# Altium project traitim.PrjPcb
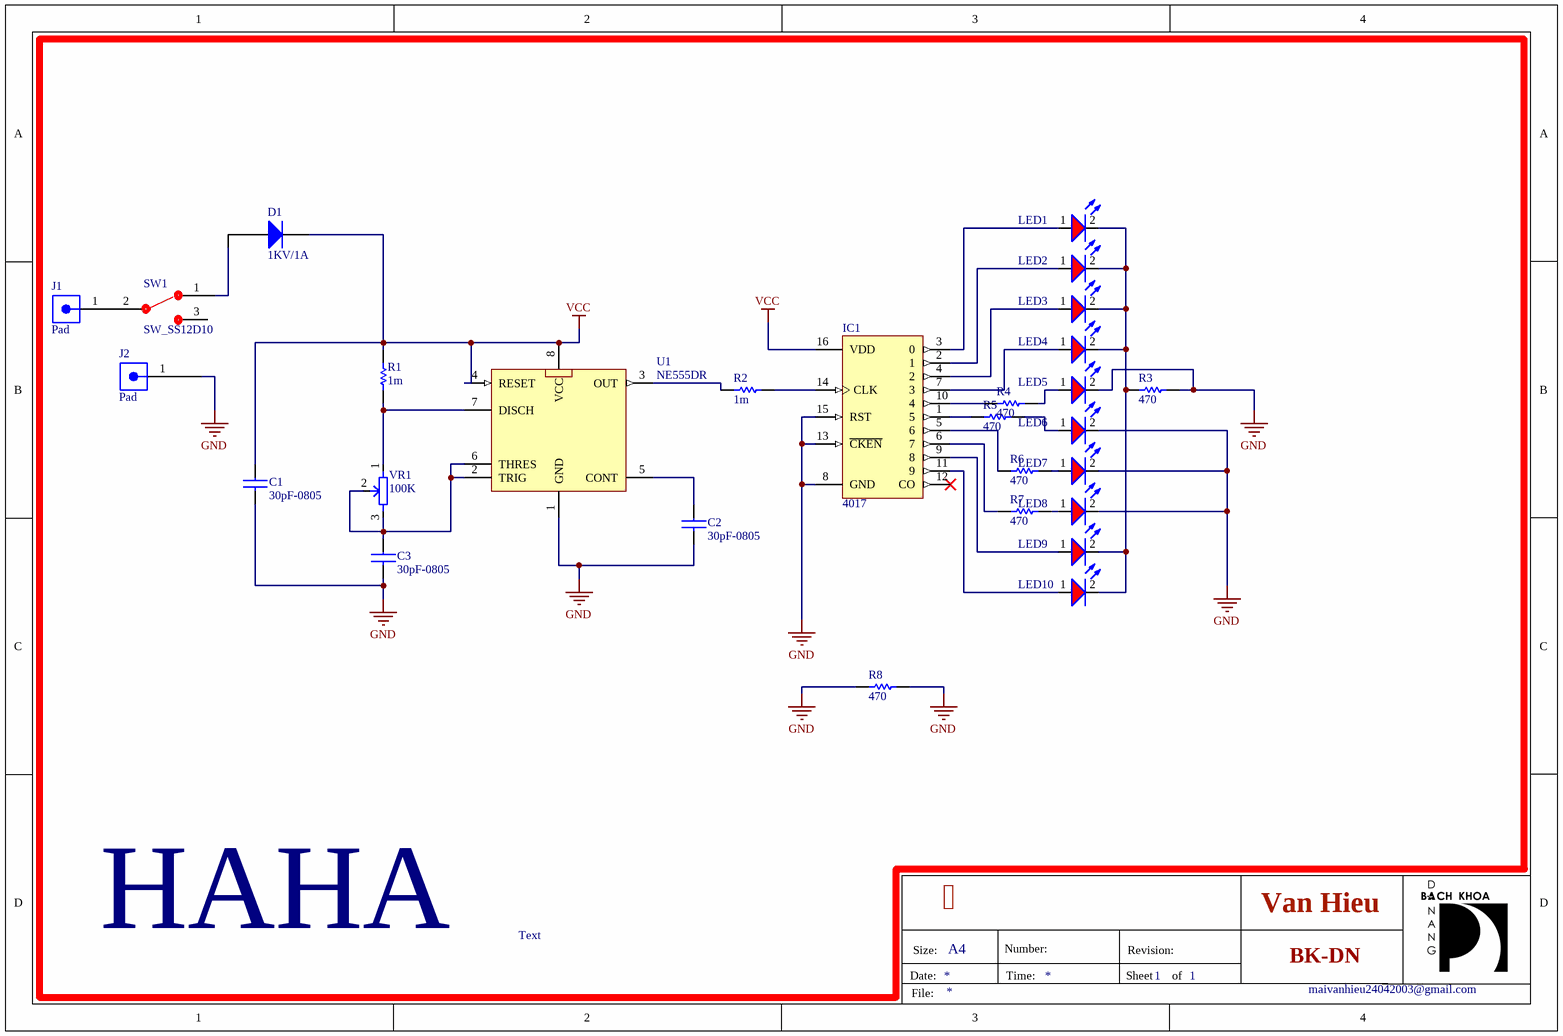
[diagram p0: Sheet2.SchDoc]
1 sheet, 28 parts. Net scope: global (net labels, ports and power ports of the same name join across sheets).
Board file: PCB2.PcbDoc

## Sheet Sheet2.SchDoc
size A4; Author: Van Hieu; Organization: BACH-KHOA-DK; SheetNumber: 1; SheetTotal: 1; Gmail: maivanhieu24042003@gmail.com

### Parts
C1  30pF-0805  [CAP0805]
C2  30pF-0805  [CAP0805]
C3  30pF-0805  [CAP0805]
D1  1KV/1A  [DIO-DO41(DO-204AL)-10P-THR]
IC1  4017  [DIP16/W0.3]
J1  Pad  [pad_smd_2x3]
J2  Pad  [pad_smd_2x3]
LED1  LED_R_5  [LED5R]  (value not drawn)
LED2  LED_R_5  [LED5R]  (value not drawn)
LED3  LED_R_5  [LED5R]  (value not drawn)
LED4  LED_R_5  [LED5R]  (value not drawn)
LED5  LED_R_5  [LED5R]  (value not drawn)
LED6  LED_R_5  [LED5R]  (value not drawn)
LED7  LED_R_5  [LED5R]  (value not drawn)
LED8  LED_R_5  [LED5R]  (value not drawn)
LED9  LED_R_5  [LED5R]  (value not drawn)
LED10  LED_R_5  [LED5R]  (value not drawn)
R1  value 1m  [RESC2012L]  (hidden comment: Resistor 10K-0805)
R2  value 1m  [RESC2012L]  (hidden comment: Resistor 10K-0805)
R3  value 470  [RES 1/4W CFR25]  (hidden comment: CF1/4W1KJ25)
R4  value 470  [RES 1/4W CFR25]  (hidden comment: CF1/4W1KJ25)
R5  value 470  [RES 1/4W CFR25]  (hidden comment: CF1/4W1KJ25)
R6  value 470  [RES 1/4W CFR25]  (hidden comment: CF1/4W1KJ25)
R7  value 470  [RES 1/4W CFR25]  (hidden comment: CF1/4W1KJ25)
R8  value 470  [RES 1/4W CFR25]  (hidden comment: CF1/4W1KJ25)
SW1  SW_SS12D10  [SW_SS12D10]
U1  NE555DR  [SOIC-8]
VR1  100K  [Bien Tro Tam Giac Dung]

### Nets
GND: C1.2 C2.2 C3.2 IC1.8(GND) IC1.13(~{CKEN}) IC1.15(RST) J2.1 LED5.2(K) LED6.2(K) LED7.2(K) LED8.2(K) R3.1 R8.1 R8.2 U1.1(GND)
VCC: C1.1 D1.2(K) IC1.16(VDD) R1.2 U1.4(RESET) U1.8(VCC)
NetC2_1: C2.1 U1.5(CONT)
NetC3_1: C3.1 U1.2(TRIG) U1.6(THRES) VR1.2 VR1.3
NetD1_1: D1.1(A) SW1.1
NetIC1_1: IC1.1(5) R5.2
NetIC1_2: IC1.2(1) LED2.1(A)
NetIC1_3: IC1.3(0) LED1.1(A)
NetIC1_4: IC1.4(2) LED3.1(A)
NetIC1_5: IC1.5(6) R6.2
NetIC1_6: IC1.6(7) R7.2
NetIC1_7: IC1.7(3) LED4.1(A)
NetIC1_9: IC1.9(8) LED9.1(A)
NetIC1_10: IC1.10(4) R4.2
NetIC1_11: IC1.11(9) LED10.1(A)
NetIC1_14: IC1.14(CLK) R2.1
NetJ1_1: J1.1 SW1.2
NetLED1_2: LED1.2(K) LED2.2(K) LED3.2(K) LED4.2(K) LED9.2(K) LED10.2(K) R3.2
NetLED5_1: LED5.1(A) R4.1
NetLED6_1: LED6.1(A) R5.1
NetLED7_1: LED7.1(A) R6.1
NetLED8_1: LED8.1(A) R7.1
NetR1_1: R1.1 U1.7(DISCH) VR1.1
NetR2_2: R2.2 U1.3(OUT)

Not connected (* = marked no-connect by the designer): IC1 12(CO)*; SW1 3

### Notes on the sheet
- HAHA
- Text
- Van Hieu
- Date:
- Size:
- A4
- Number:
- Time:
- Sheet
- Revision:
- of
- BK-DN
- File:
- maivanhieu24042003@gmail.com

### Library data of the parts
C1-C3 = CC0805JRNPO9BN300: CAP CER 30PF 50V NPO 0805; Manufacturer: Yageo; Tolerance: ±5%; Temperature Coefficient: C0G, NP0; Notification: Current market demand for these product types have resulted in fluctuating and extending lead times. Lead times may differ.; Supplier 1: Digi-Key; Manufacturer Part Number: CC0805JRNPO9BN300; RoHS: RoHS Compliant; Category: Capacitors; Stock 1: 0; Pricing 1: 1=0.15, 10=0.107, 100=0.0503, 500=0.03524, 1000=0.02918 (USD); Packaging: Cut Tape (CT); Part Status: Active; Voltage - Rated: 50V; Operating Temperature: -55°C ~ 125°C; Features: High Voltage; Ratings: -; Applications: General Purpose; Failure Rate: -; Mounting Type: Surface Mount, MLCC; Package / Case: 0805 (2012 Metric); Size / Dimension: 0.079" L x 0.049" W (2.00mm x 1.25mm); Height - Seated (Max): -; Thickness (Max): 0.028" (0.70mm); Lead Spacing: -; Lead Style: -; ComponentLink1URL: http://www.yageo.com/documents/recent/UPY-GP_NP0_16V-to-50V_16.pdf; ComponentLink1Description: http://www.yageo.com/documents/recent/UPY-GP_NP0_16V-to-50V_16.pdf; Supplier Part Number 1: 311-4234-1-ND
D1 = SMC-1N4007: DIO GEN 1000V 1A DO41 THR; MFR: NA; UNIT: PCS; MFR PN: SMC-1N4007; LINK: NA; PRICE: NA
IC1 = 4017: Decade Counter/Divider with 10 Decoded Outputs; Designed by: VanDungEvn; Value: CD4017
J1 J2 = Pad: Ports: 1; Positions/Loaded: Port1 - 4/2; PerformanceCategory: 3; PCB_Mounting: Thru-Hole; PCB_Thickness: 0.125"; DrillSize: Nominal, Rounded to nearest 0.05mm; PCB_Layout: Complies with Manufacturer's Recommendation.; Published: 25-Jun-2002; DatasheetDocument: 20-Nov-2001; PackageDocument: 20-Nov-2001; PackageReference: 42878-4410; Publisher: Altium Limited; ComponentLink1Description: Manufacturer Link; ComponentLink1URL: http://www.molex.com/; ComponentLink2Description: Datasheet; ComponentLink2URL: http://www.molex.com/cmc_upload/common_files/1212003_42878catalogpage.pdf
LED1-LED10 = LED_RED_5MM: LED Red 5mm; ComponentLink1Description: Datasheet; ComponentLink1URL: D:\Dropbox\Datasheets\Opto and Illumination\LEDs\SMD LED.pdf; Unit Price: 0.0476
R1 R2 = Resistor: Semiconductor Resistor; Published: 8-Jun-2000; LatestRevisionDate: 17-Jul-2002; LatestRevisionNote: Re-released for DXP Platform.; PackageReference: AXIAL-0.5; Publisher: Altium Limited
R3-R8 = CF1/4W1KJ25: 470
SW1 = SW_SS12D10: CONG TAC GAT LON_HIEULIB
U1 = NE555DR: Timers & Support Products Precision; Manufacturer: Texas Instruments; High Level Output Current: 200 mA; Low Level Output Current: - 200 mA; Number of Internal Timers: 1 Timer; Operating Supply Current: 2 mA; Supply Voltage - Max: 16 V; Supply Voltage - Min: 4.5 V; Supplier 1: Mouser; Manufacturer Part Number: NE555DR; RoHS: RoHS Compliant; Category: Timers & Support Products; Stock 1: 19453; Pricing 1: 1=0.370, 10=0.248, 100=0.144, 500=0.117, 1000=0.090, 2500=0.077, 10000=0.070, 25000=0.066, 50000=0.063 (USD); Height: 1.58 mm; Length: 4.9 mm; Package / Case: SOIC-8; Packaging: Cut Tape; Series: NE555; Type: Standard; Width: 3.91 mm; Brand: Texas Instruments; Mounting Style: SMD/SMT; Maximum Operating Temperature: + 70 C; Minimum Operating Temperature: 0 C; Product Type: Timers & Support Products; Standard Pack Qty: 2500; Subcategory: Clock & Timer ICs; RoHS - Mouser: Y; Minimum Order Quantity: 1; Reeling: True; Supplier Part Number 1: 595-NE555DR
VR1 = Bien tro tam giac 100K Dung: Cắm; Don_Vi: Con; Ten_Linh_Kien: Biến Trở Tam Giác 104-100K RM065; Ma_Hang: MH003711; Chung_Loai: Cắm; Ghi_Chu: *; Kieu_Chan: *